# Altium project DM-USB2CAN.PrjPcb
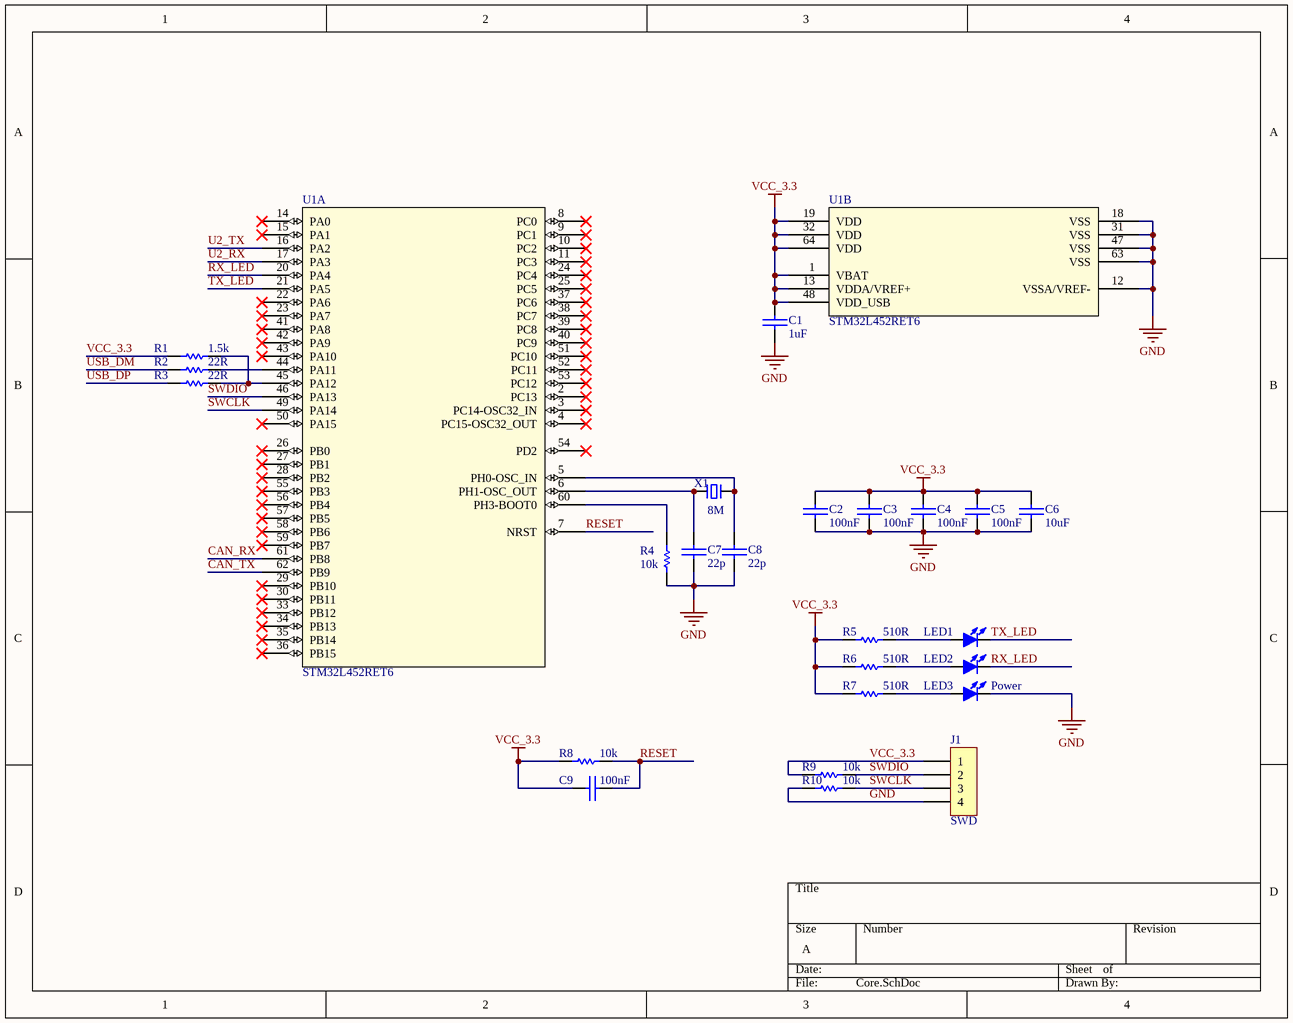
[diagram p0: Core.SchDoc]
3 sheets, 41 parts. Net scope: global (net labels, ports and power ports of the same name join across sheets).
Board file: DM-USB2CAN.PcbDoc
Sheets:
  Core.SchDoc
  Power_USB.SchDoc
  CAN_UART.SchDoc

## Sheet Core.SchDoc
size A; SheetNumber: 1; SheetTotal: 3

### Parts
C1  1uF  [C 0603_L]
C2  100nF  [C 0603_L]
C3  100nF  [C 0603_L]
C4  100nF  [C 0603_L]
C5  100nF  [C 0603_L]
C6  10uF  [C 0603_L]
C7  22p  [C 0603_L]
C8  22p  [C 0603_L]
C9  100nF  [C 0603_L]
J1  SWD  [Pin HDR1X4/2.54mm-S]
LED1  CAN_TX  [LED 0805R]  (value not drawn)
LED2  CAN_RX  [LED 0805G]  (value not drawn)
LED3  Power  [LED 0805B]
R1  1.5k  [0603R]
R2  22R  [0603R]
R3  22R  [0603R]
R4  10k  [0603R]
R5  510R  [0603R]
R6  510R  [0603R]
R7  510R  [0603R]
R8  10k  [0603R]
R9  10k  [0603R]
R10  10k  [0603R]
U1  STM32L452RET6  [LQFP64-10*10]  (parts A,B of 2)
X1  8M  [OSC HC-49S]

### Nets
GND: C1.1 C2.1 C3.1 C4.1 C5.1 C6.1 C7.1 C8.1 J1.4 LED3.2(K) R4.1 R10.1 U1.12(VSSA/VREF-) U1.18(VSS) U1.31(VSS) U1.47(VSS) U1.63(VSS)
VCC_3.3: C1.2 C2.2 C3.2 C4.2 C5.2 C6.2 C9.2 J1.1 R1.1 R5.1 R6.1 R7.1 R8.1 R9.1 U1.1(VBAT) U1.13(VDDA/VREF+) U1.19(VDD) U1.32(VDD) U1.48(VDD_USB) U1.64(VDD)
CAN_RX: U1.61(PB8)
CAN_TX: U1.62(PB9)
RESET: C9.1 R8.2 U1.7(NRST)
RX_LED: LED2.2(K) U1.20(PA4)
SWCLK: J1.3 R10.2 U1.49(PA14)
SWDIO: J1.2 R9.2 U1.46(PA13)
TX_LED: LED1.2(K) U1.21(PA5)
U2_RX: U1.17(PA3)
U2_TX: U1.16(PA2)
USB_DM: R2.1
USB_DP: R3.1
NetC7_2: C7.2 U1.6(PH1-OSC_OUT) X1.1
NetC8_2: C8.2 U1.5(PH0-OSC_IN) X1.2
NetLED1_1: LED1.1(A) R5.2
NetLED2_1: LED2.1(A) R6.2
NetLED3_1: LED3.1(A) R7.2
NetR1_2: R1.2 R3.2 U1.45(PA12)
NetR2_2: R2.2 U1.44(PA11)
NetR4_2: R4.2 U1.60(PH3-BOOT0)

Not connected (* = marked no-connect by the designer): U1 2(PC13)* 3(PC14-OSC32_IN)* 4(PC15-OSC32_OUT)* 8(PC0)* 9(PC1)* 10(PC2)* 11(PC3)* 14(PA0)* 15(PA1)* 22(PA6)* 23(PA7)* 24(PC4)* 25(PC5)* 26(PB0)* 27(PB1)* 28(PB2)* 29(PB10)* 30(PB11)* 33(PB12)* 34(PB13)* 35(PB14)* 36(PB15)* 37(PC6)* 38(PC7)* 39(PC8)* 40(PC9)* 41(PA8)* 42(PA9)* 43(PA10)* 50(PA15)* 51(PC10)* 52(PC11)* 53(PC12)* 54(PD2)* 55(PB3)* 56(PB4)* 57(PB5)* 58(PB6)* 59(PB7)*

### Library data of the parts
C1-C9 = CAP: 无极性电容
J1 = Pin HDR1X4
LED1-LED3 = LED-SMD: 贴片LED; 版权归属: 封装库来自淘宝 ID：黄晶宝石; BOM名称: 贴片LED; 学习资源: https://shop463601444.taobao.com
R1-R10 = RES
U1 = STM32L452RET6: No Description Available; Mfr_Name: STMicroelectronics; RefDes: RefDes; Type: Type
X1 = XTAL-2P: 2脚无源脚晶振

## Sheet Power_USB.SchDoc
size A; SheetNumber: 2; SheetTotal: 3
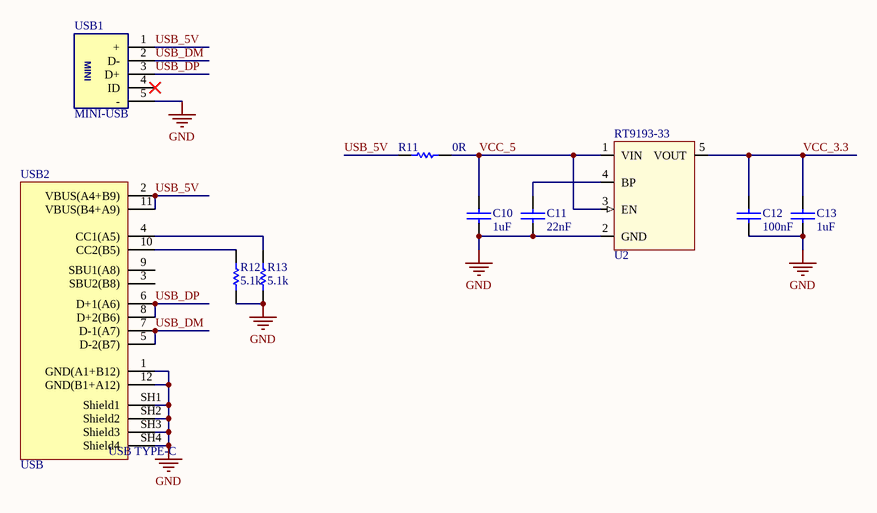
[diagram p1: Power_USB.SchDoc]

### Parts
C10  1uF  [C 0603_L]
C11  22nF  [C 0603_L]
C12  100nF  [C 0603_L]
C13  1uF  [C 0603_L]
R11  0R  [0603R]
R12  5.1k  [0603R]
R13  5.1k  [0603R]
U2  RT9193-33  [SOT23-5L]
USB1  MINI-USB  [USB-MINI-A]
USB2  USB  [USB Type-C]

### Nets
GND: C10.1 C11.1 C12.1 C13.1 R12.2 R13.2 U2.2(GND) USB1.5(-) USB2.1(GND(A1+B12)) USB2.12(GND(B1+A12)) USB2.SH1(Shield1) USB2.SH2(Shield2) USB2.SH3(Shield3) USB2.SH4(Shield4)
VCC_3.3: C12.2 C13.2 U2.5(VOUT)
USB_5V: R11.1 USB1.1(+) USB2.2(VBUS(A4+B9)) USB2.11(VBUS(B4+A9))
USB_DM: USB1.2(D-) USB2.5(D-2(B7)) USB2.7(D-1(A7))
USB_DP: USB1.3(D+) USB2.6(D+1(A6)) USB2.8(D+2(B6))
VCC_5: C10.2 R11.2 U2.1(VIN) U2.3(EN)
NetC11_2: C11.2 U2.4(BP)
NetR12_1: R12.1 USB2.10(CC2(B5))
NetR13_1: R13.1 USB2.4(CC1(A5))

Not connected (* = marked no-connect by the designer): USB1 4(ID)*; USB2 3(SBU2(B8)) 9(SBU1(A8))

### Notes on the sheet
- (in symbol MINI-USB) MINI
- (in symbol USB Type-C) USB TYPE-C

### Library data of the parts
C10-C13 = CAP: 无极性电容
R11-R13 = RES
U2 = RT9193X_5P: ICA_MFR_NAME: RICHTEK; ICA_PARTNUM: $$2191094$$RT9193-15CU5; Part Number: TMP-13
USB2 = USB Type-C: 12P TypeC 母座

## Sheet CAN_UART.SchDoc
size A; SheetNumber: 3; SheetTotal: 3
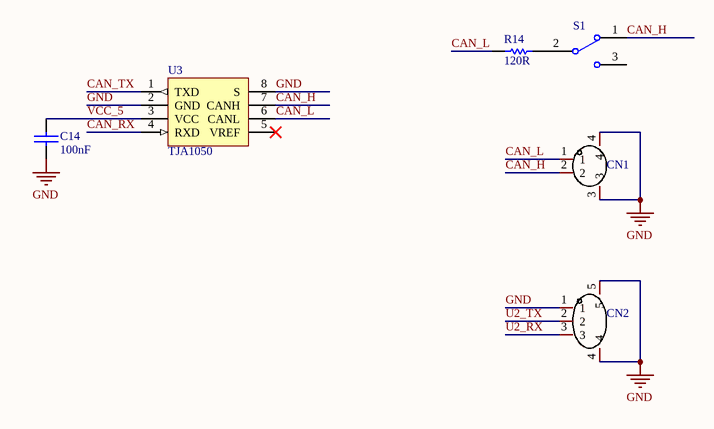
[diagram p2: CAN_UART.SchDoc]

### Parts
C14  100nF  [C 0603_L]
CN1  GH-1.25-2P  [GH1.25-WT-2P]  (value not drawn)
CN2  GH-1.25-3P  [GH1.25-WT-3P]  (value not drawn)
R14  120R  [0603R]
S1  SS-12F23  [SK12D07VG3]  (value not drawn)
U3  TJA1050  [SOP8_N]

### Nets
GND: C14.1 CN1.3 CN1.4 CN2.1 CN2.4 CN2.5 U3.2(GND) U3.8(S)
CAN_H: CN1.2 S1.1 U3.7(CANH)
CAN_L: CN1.1 R14.2 U3.6(CANL)
CAN_RX: U3.4(RXD)
CAN_TX: U3.1(TXD)
U2_RX: CN2.3
U2_TX: CN2.2
VCC_5: C14.2 U3.3(VCC)
NetR14_1: R14.1 S1.2

Not connected (* = marked no-connect by the designer): S1 3; U3 5(VREF)*

### Library data of the parts
C14 = CAP: 无极性电容
R14 = RES
S1 = SSW-1P: 1路波动开关; BOM名称: 波动开关; 版权归属: 封装库来自淘宝 ID：黄晶宝石; 学习资源: https://shop463601444.taobao.com
U3 = TJA1050: CAN总线收发芯片; 版权归属: 封装库来自淘宝 ID：黄晶宝石; BOM名称: CAN总线收发芯片; 学习资源: https://shop463601444.taobao.com

## Nets that join several sheets
GND: Core (17 pins), Power_USB (14 pins), CAN_UART (8 pins)
VCC_3.3: Core (20 pins), Power_USB (C12.2 C13.2 U2.5)
CAN_RX: Core (U1.61), CAN_UART (U3.4)
CAN_TX: Core (U1.62), CAN_UART (U3.1)
U2_RX: Core (U1.17), CAN_UART (CN2.3)
U2_TX: Core (U1.16), CAN_UART (CN2.2)
USB_DM: Core (R2.1), Power_USB (USB1.2 USB2.5 USB2.7)
USB_DP: Core (R3.1), Power_USB (USB1.3 USB2.6 USB2.8)
VCC_5: Power_USB (C10.2 R11.2 U2.1 U2.3), CAN_UART (C14.2 U3.3)